# EAGLE schematic AVR_ISP_with_RS232 (EAGLE 4.16)

## Sheet 1 of 2
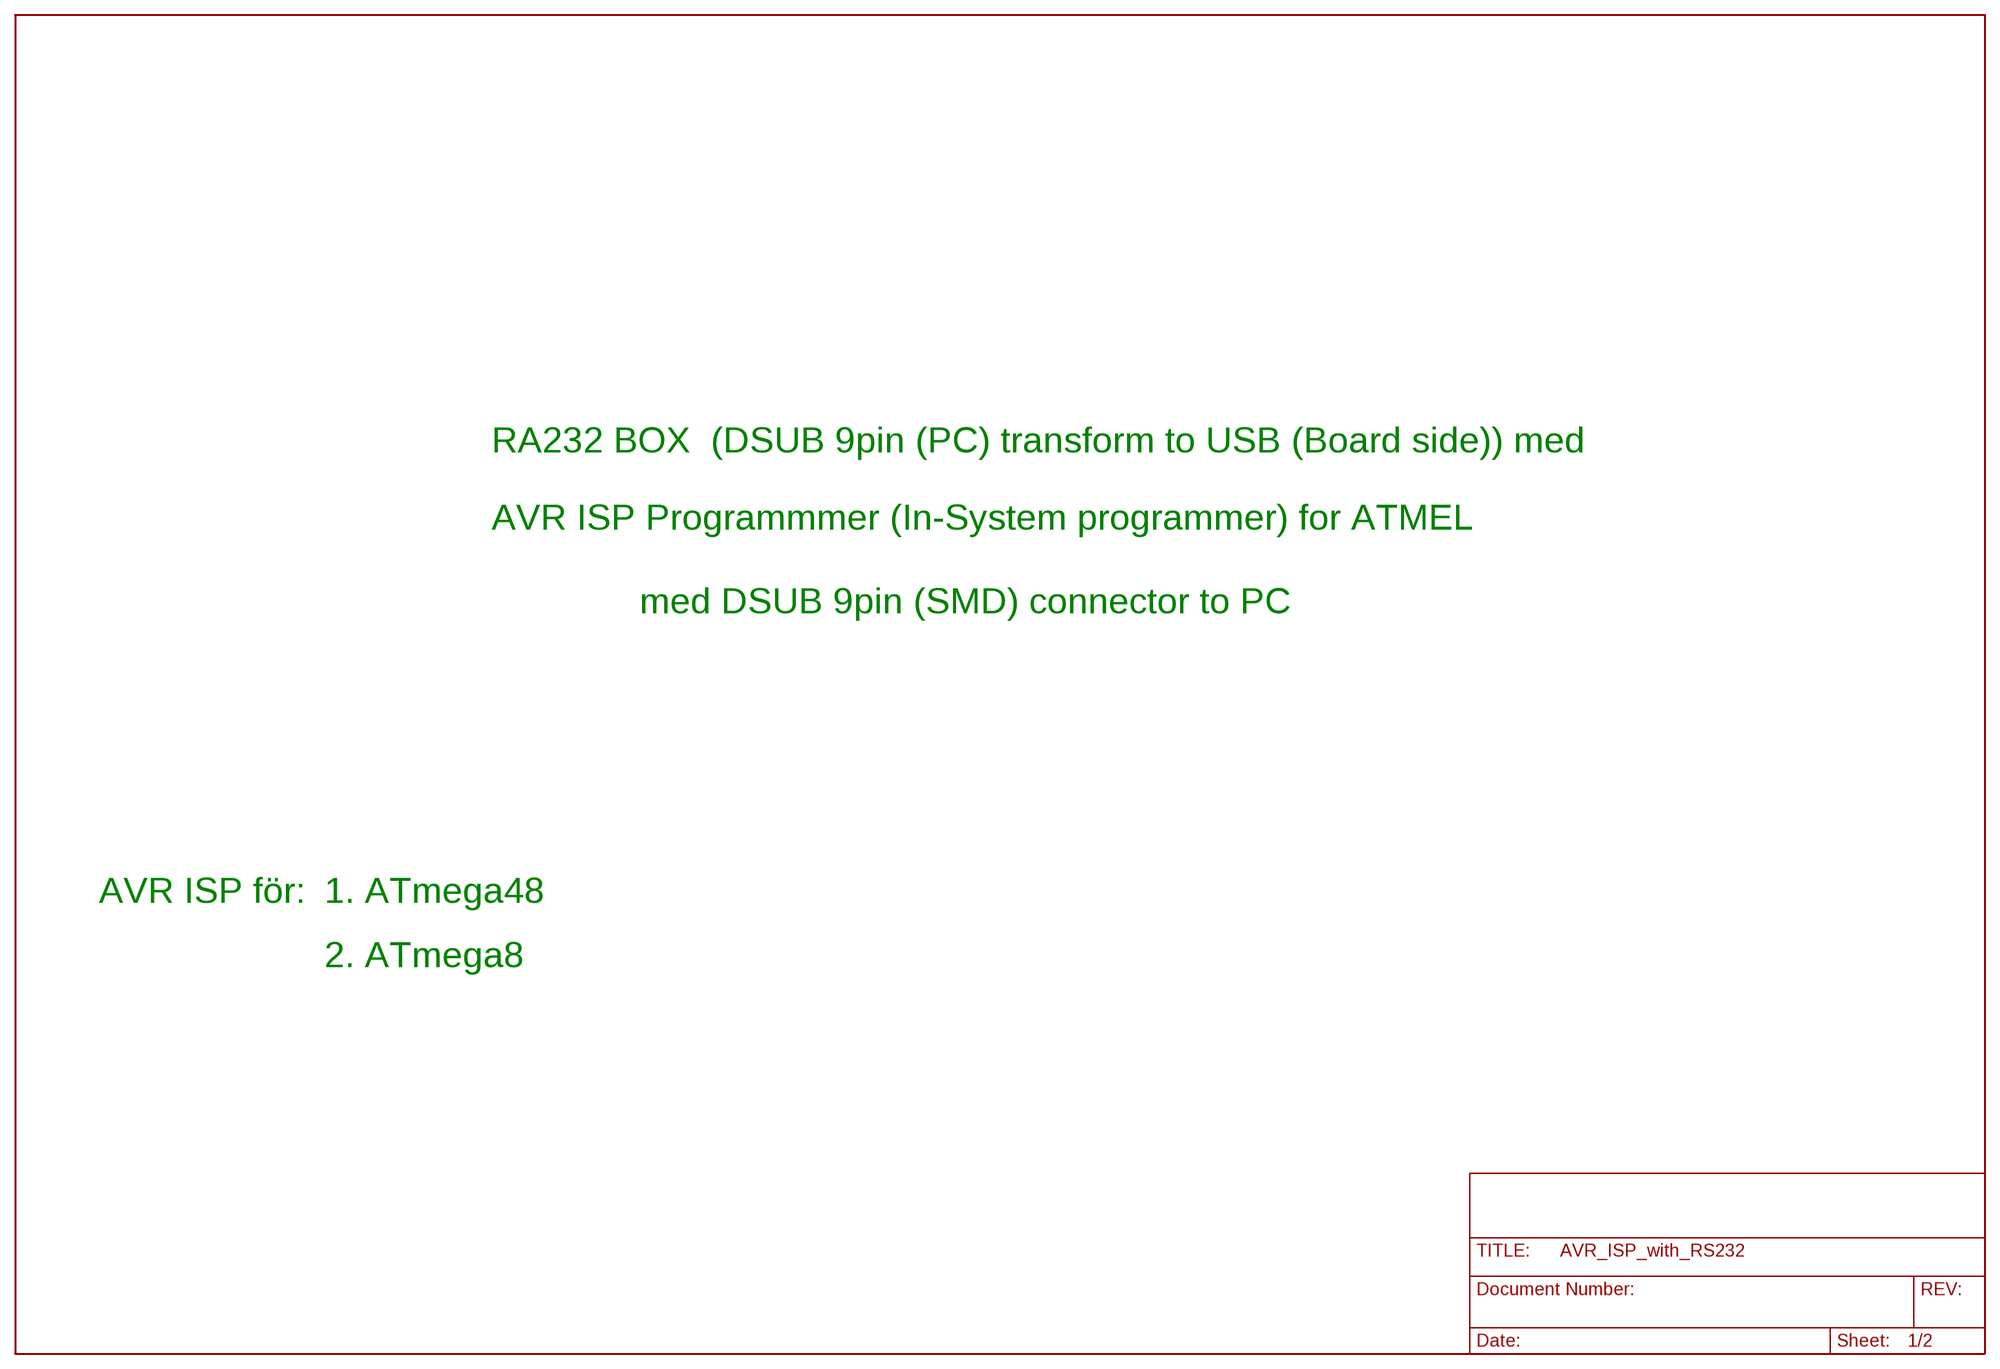
[diagram p0: schematic, sheet 1]

### Notes on the sheet
- RA232 BOX  (DSUB 9pin (PC) transform to USB (Board side)) med
- AVR ISP Programmmer (In-System programmer) for ATMEL
- AVR ISP Programer (In-System-Programmer)
- med DSUB 9pin (SMD) connector to PC
- for Atmel AVR Microcontrollers
- AVR ISP för: | 1. ATmega48
- 2. ATmega8

## Sheet 2 of 2
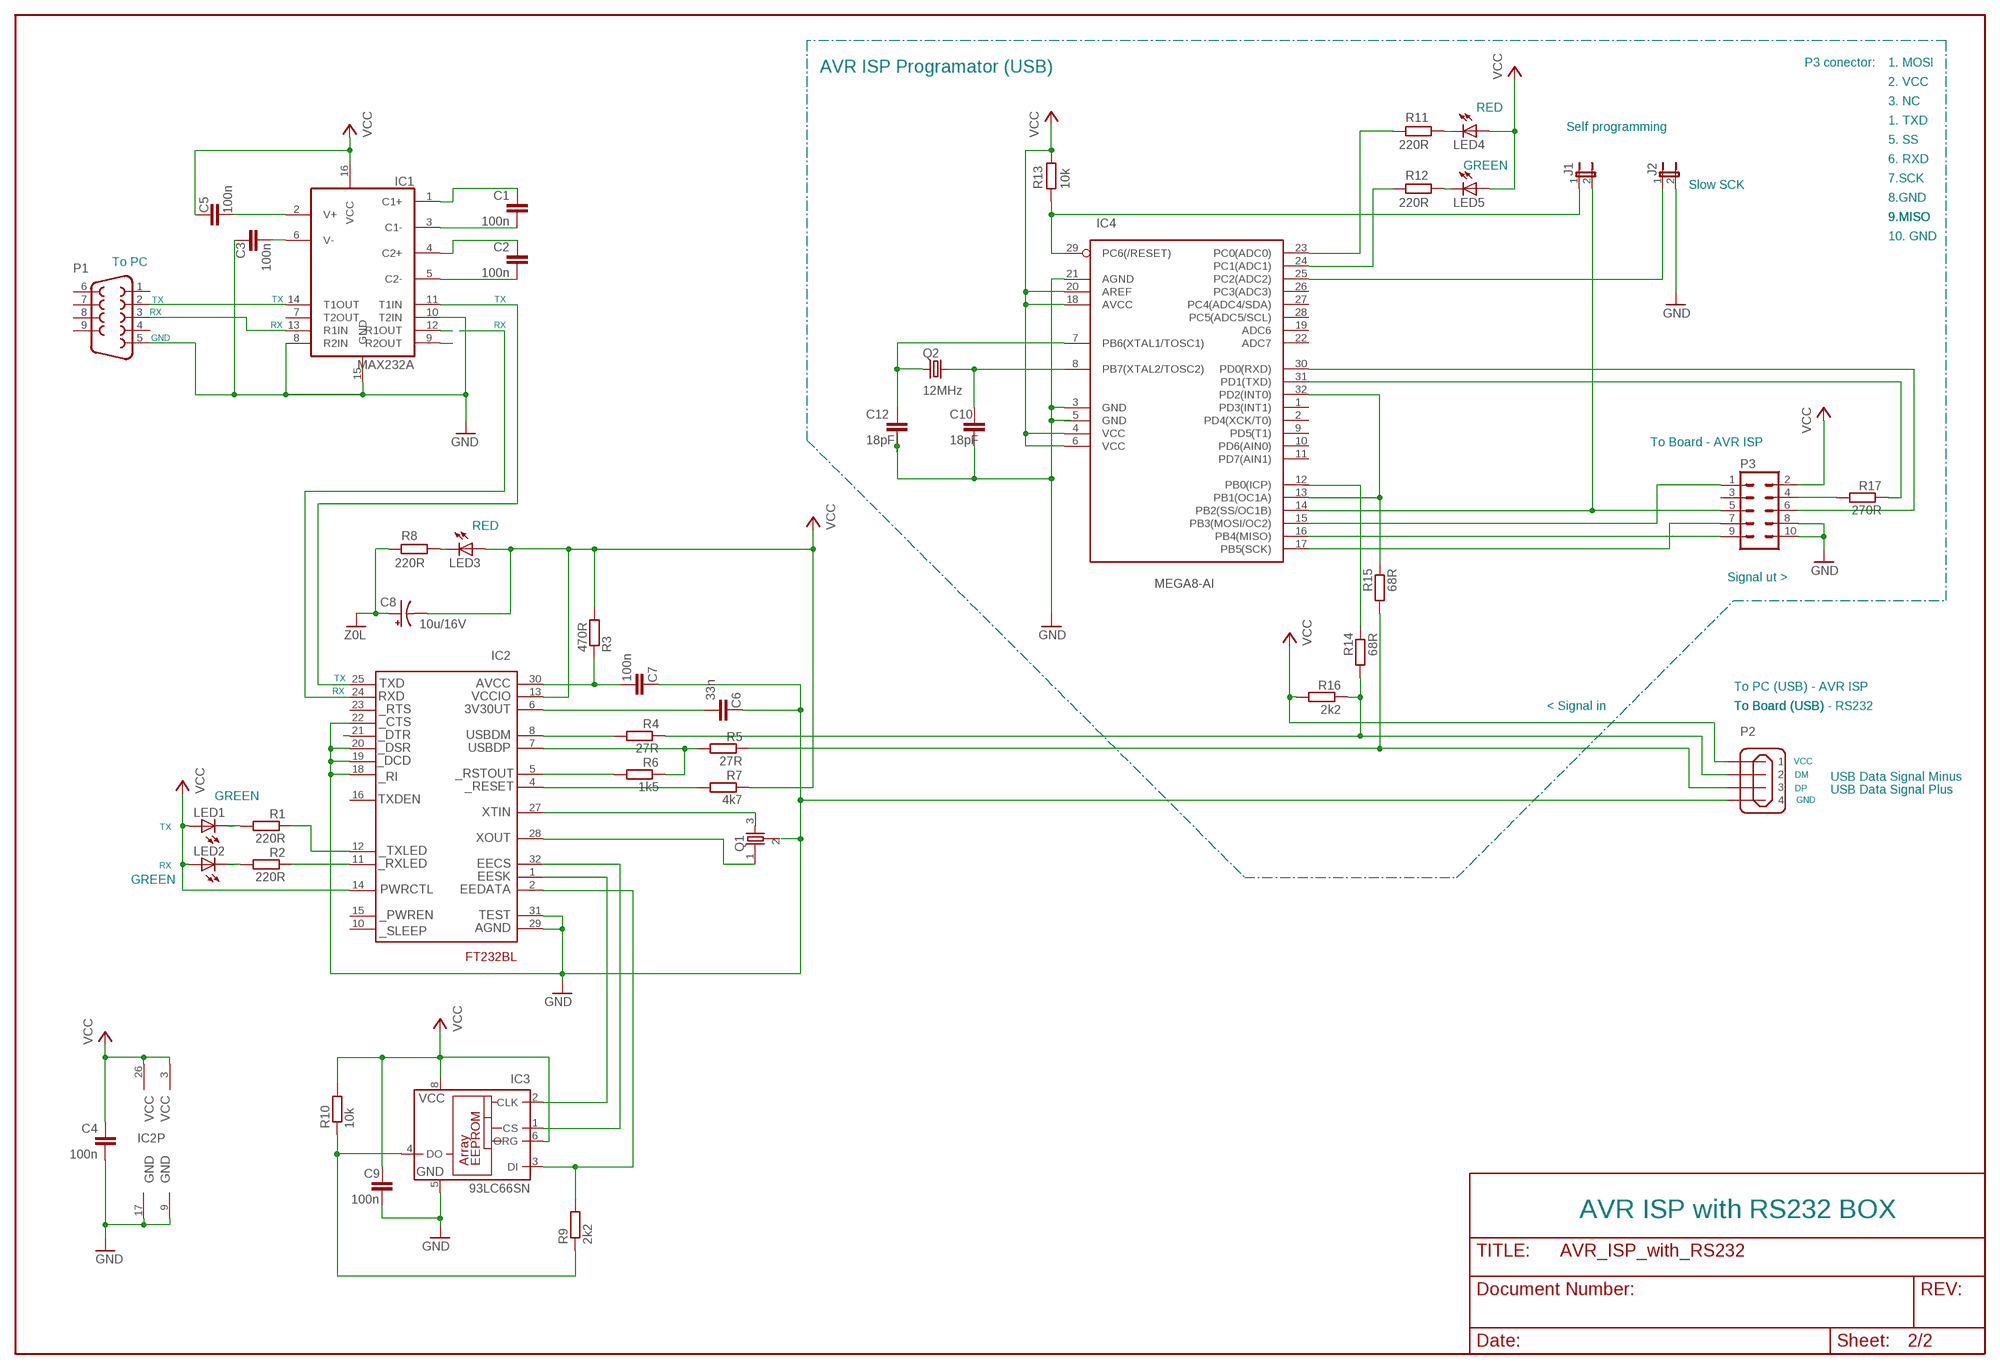
[diagram p1: schematic, sheet 2]

### Parts
C1  100n  C-EUC0805K  [C0805K]
C2  100n  C-EUC0805K  [C0805K]
C3  100n  C-EUC0805K  [C0805K]
C4  100n  C-EUC0805K  [C0805K]
C5  100n  C-EUC0805K  [C0805K]
C6  33n  C-EUC0805K  [C0805K]
C7  100n  C-EUC0805K  [C0805K]
C8  10u/16V  CPOL-USB  [PANASONIC_B]
C9  100n  C-EUC0805K  [C0805K]
C10  18pF  C-EUC0805K  [C0805K]
C12  18pF  C-EUC0805K  [C0805K]
IC1  MAX232A  [SO16]
IC2  FT232BL  FT232BM  [TQFP32-08]
IC3  93LC66SN  [SO-08]
IC4  MEGA8-AI  [TQFP32-08]
J1  JP1E  [JP1]
J2  JP1E  [JP1]
LED1  LED3MM  [LED3MM]
LED2  LED3MM  [LED3MM]
LED3  LED3MM  [LED3MM]
LED4  LED3MM  [LED3MM]
LED5  LED3MM  [LED3MM]
P1  D_SUB_9PIN_SMD  [D_SUB_DON_SMD]
P2  USB_4POL_PCB_FEMALE  [USB_4POL_PCB_FEMALE]
P3  AMP_L_90_10P  [AMP_L_90_10P]
Q1  MURATA_RESONATOR  [MURATA_RESONATOR]
Q2  12MHz  CRYSTALSM49  [SM49]
R1  220R  R-EU_M0805  [M0805]
R2  220R  R-EU_M0805  [M0805]
R3  470R  R-EU_M0805  [M0805]
R4  27R  R-EU_M0805  [M0805]
R5  27R  R-EU_M0805  [M0805]
R6  1k5  R-EU_M0805  [M0805]
R7  4k7  R-EU_M0805  [M0805]
R8  220R  R-EU_M0805  [M0805]
R9  2k2  R-EU_M0805  [M0805]
R10  10k  R-EU_M0805  [M0805]
R11  220R  R-EU_M0805  [M0805]
R12  220R  R-EU_M0805  [M0805]
R13  10k  R-EU_M0805  [M0805]
R14  68R  R-EU_M0805  [M0805]
R15  68R  R-EU_M0805  [M0805]
R16  2k2  R-EU_M0805  [M0805]
R17  270R  R-EU_M0805  [M0805]

### Nets
0V: C4.2 C6.1 C7.1 C8.+ C9.2 IC2.9 IC2.17 IC2.18 IC2.19 IC2.20 IC2.22 IC2.29 IC2.31 IC3.5(GND) IC4.23(PC0(ADC0)) P2.4 Q1.2 R8.1 R11.1 ; supply symbol labelled GND, Z0L
+5V: IC4.4(VCC) IC4.6(VCC) IC4.18(AVCC) IC4.20(AREF) P3.2 R13.2 ; supply symbol labelled VCC
GND: C3.2 C10.2 C12.2 IC1.8(R2IN) IC1.10(T2IN) IC1.15(GND) IC4.3(GND) IC4.5(GND) IC4.21(AGND) J2.2 P1.5 P3.8 P3.10
N$1: IC2.12 R1.1
N$2: IC1.13(R1IN) P1.3
N$3: IC2.11 R2.1
N$4: C10.1 IC4.8(PB7(XTAL2/TOSC2)) Q2.2
N$5: LED1.K(C) R1.2
N$6: LED2.K(C) R2.2
N$7: C6.2 IC2.6
N$8: C7.2 IC2.30 R3.1
N$9: IC2.8 R4.2
N$10: P2.2 R4.1 R14.2 R16.1
N$11: IC2.7 R5.2 R6.1
N$12: P2.3 R5.1 R15.2
N$13: IC2.5 R6.2
N$14: IC2.4 R7.2
N$15: IC2.24
N$16: IC2.1 IC3.2(CLK)
N$17: C8.- LED3.A
N$18: IC2.27 Q1.3
N$19: IC2.28 Q1.1
N$20: IC1.12(R1OUT)
N$21: IC2.32 IC3.1(CS)
N$22: LED4.K(C) R11.2
N$23: IC1.11(T1IN) IC2.25
N$24: IC1.14(T1OUT) P1.2
N$25: IC3.4(DO) R9.1 R10.1
N$26: LED3.K(C) R8.2
N$34: IC1.9(R2OUT)
N$36: C2.2 IC1.5(C2-)
N$37: C1.1 IC1.1(C1+)
N$38: C1.2 IC1.3(C1-)
N$39: IC2.2 IC3.3(DI) R9.2
N$40: C5.1 IC1.2(V+)
N$41: C3.1 IC1.6(V-)
N$44: IC2.21
N$46: C2.1 IC1.4(C2+)
N$47: C12.1 IC4.7(PB6(XTAL1/TOSC1)) Q2.1
N$48: LED5.K(C) R12.2
N$53: P3.4 R17.2
N$54: IC4.31(PD1(TXD)) R17.1
N$55: IC4.30(PD0(RXD)) P3.6
N$56: IC4.15(PB3(MOSI/OC2)) P3.1
N$57: IC4.17(PB5(SCK)) P3.7
N$58: IC4.14(PB2(SS/OC1B)) J1.2 P3.5
N$59: IC4.29(PC6(/RESET)) J1.1 R13.1
N$60: IC4.25(PC2(ADC2)) J2.1
N$61: IC4.12(PB0(ICP)) R14.1
N$62: IC4.24(PC1(ADC1)) R12.1
N$63: IC4.13(PB1(OC1A)) IC4.32(PD2(INT0)) R15.1
N$67: IC4.16(PB4(MISO)) P3.9
VCC: C4.1 C5.2 C9.1 IC1.16(VCC) IC2.3 IC2.13 IC2.14 IC2.26 IC3.6(ORG) IC3.8(VCC) LED1.A LED2.A P2.1 R3.2 R7.1 R10.2 R16.2
VCCINT: LED4.A LED5.A ; supply symbol labelled VCC
Unconnected: IC1.7(T2OUT) IC2.10 IC2.15 IC2.16 IC2.23 IC3.7(NU) IC4.1(PD3(INT1)) IC4.2(PD4(XCK/T0)) IC4.9(PD5(T1)) IC4.10(PD6(AIN0)) IC4.11(PD7(AIN1)) IC4.19(ADC6) IC4.22(ADC7) IC4.26(PC3(ADC3)) IC4.27(PC4(ADC4/SDA)) IC4.28(PC5(ADC5/SCL)) P1.1 P1.4 P1.6 P1.7 P1.8 P1.9 P3.3

### Notes on the sheet
- P3 conector: | 1. MOSI
- AVR ISP Programator (USB)
- 2. VCC
- 3. NC
- RED
- 1. TXD
- Self programming
- 5. SS
- 6. RXD
- GREEN
- 7.SCK
- Slow SCK
- 8.GND
- 9.MISO | 9.MISO
- 10. GND
- To PC
- TX | TX | TX
- RX
- RX | RX
- GND
- To Board - AVR ISP
- RED
- Signal ut >
- TX
- To PC (USB) - AVR ISP
- RX
- < Signal in | To Board (USB) | To Board (USB) - RS232
- VCC
- DM | USB Data Signal Minus
- DP | USB Data Signal Plus
- GREEN
- GND
- TX
- RX
- GREEN
- AVR ISP with RS232 BOX

## Library data of the parts
C1-C7 C9 C10 C12 = rcl:C-EU: CAPACITOR, European symbol
C8 = rcl:CPOL-US: POLARIZED CAPACITOR, American symbol
IC1 = sc-librari:MAX232A
IC2 = sc-librari:FT232BM: MICROCONTROLLER 2 Kbytes FLASH 128 bytes SRAM 128 bytes EEPROM UART 6-channel 10-bit ADC
IC3 = microchip:93*: Serial EPROM 1 K/2 K/4 K, low voltage, Microwire
IC4 = atmel:MEGA8: MICROCONTROLLER 8 Kbytes FLASH 1 kbytes SRAM 512 bytes EEPROM USART 6-channel 10 bit ADC 2-channel 8 bit ADC Source: avr.lbr
J1 J2 = jumper:JP1E: JUMPER
LED1-LED5 = led:LED: LED OSRAM: - CHIPLED LG R971, LG N971, LY N971, LG Q971, LY Q971, LO R971, LY R971 LH N974, LH R974 LS Q976, LO Q976, LY Q976 LO Q996 - Hyper CHIPLED LW Q18S LB Q993, LB Q99A, LB R99A - SideLED LS A670, LO A670, LY A670, LG A670, LP A670 LB A673, LV A673, LT A673, LW A673 LH A674 LY A675 LS A676, LA A676, LO A676, LY A676, LW A676 LS A679, LY A679, LG A679 - Hyper Micro SIDELED® LS Y876, LA Y876, LO Y876, LY Y876 LT Y87S - SmartLED LW L88C, LW L88S LB L89C, LB L89S, LG L890 LS L89K, LO L89K, LY L89K LS L896, LA L896, LO L896, LY L896 - TOPLED LS T670, LO T670, LY T670, LG T670, LP T670 LSG T670, LSP T670, LSY T670, LOP T670, LYG T670 LG T671, LOG T671, LSG T671 LB T673, LV T673, LT T673, LW T673 LH T674 LS T676, LA T676, LO T676, LY T676, LB T676, LH T676, LSB T676, LW T676 LB T67C, LV T67C, LT T67C, LS T67K, LO T67K, LY T67K, LW E67C LS E67B, LA E67B, LO E67B, LY E67B, LB E67C, LV E67C, LT E67C LW T67C LS T679, LY T679, LG T679 LS T770, LO T770, LY T770, LG T770, LP T770 LB T773, LV T773, LT T773, LW T773 LH T774 LS E675, LA E675, LY E675, LS T675 LS T776, LA T776, LO T776, LY T776, LB T776 LHGB T686 LT T68C, LB T68C - Hyper Mini TOPLED® LB M676 - Mini TOPLED Santana® LG M470 LS M47K, LO M47K, LY M47K Source: http://www.osram.convergy.de/
P1 = sc-librari:D_SUB_9PIN_SMD
P2 = sc-librari:USB_4POL_PCB_FEMALE
P3 = sc-librari:AMP_L_90_10P
Q1 = lbm:MURATA_RESONATOR
Q2 = crystal:CRYSTAL: CRYSTAL
R1-R17 = rcl:R-EU_: RESISTOR, European symbol